# Altium schematic sheet Interactive.SchDoc
size A4
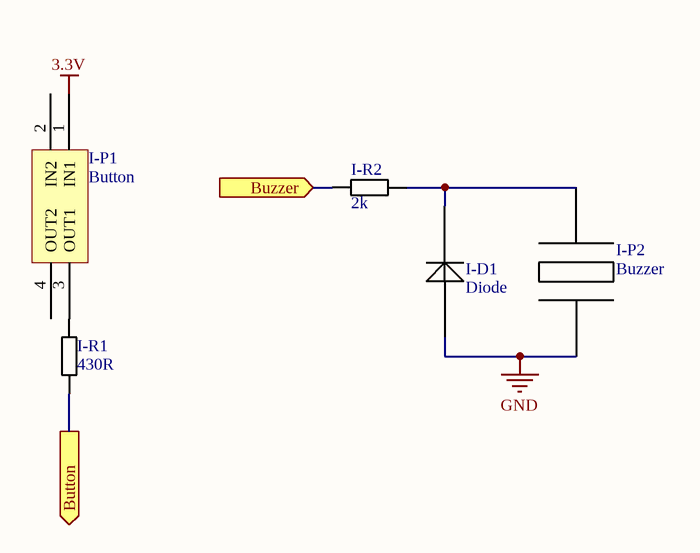
[diagram p0: Interactive.SchDoc]

## Parts
I-D1  Diode  [SC-90]
I-P1  Button  [Button]
I-P2  Buzzer  [PKLCS1212E2000-R1]
I-R1  430R  [R 0805 / 2012]
I-R2  2k  [R 0805 / 2012]

## Ports
Button (out), Buzzer (in)

## Nets
3.3V: I-P1.1(IN1)
GND: I-D1.2 I-P2.2(-)
Button: I-R1.1 ; port Button
Buzzer: I-R2.2 ; port Buzzer
NetI-D1_1: I-D1.1 I-P2.1(+) I-R2.1
NetI-P1_3: I-P1.3(OUT1) I-R1.2

Not connected (* = marked no-connect by the designer): I-P1 2(IN2) 4(OUT2)

## Library data of the parts
I-R1 I-R2 = Resistor